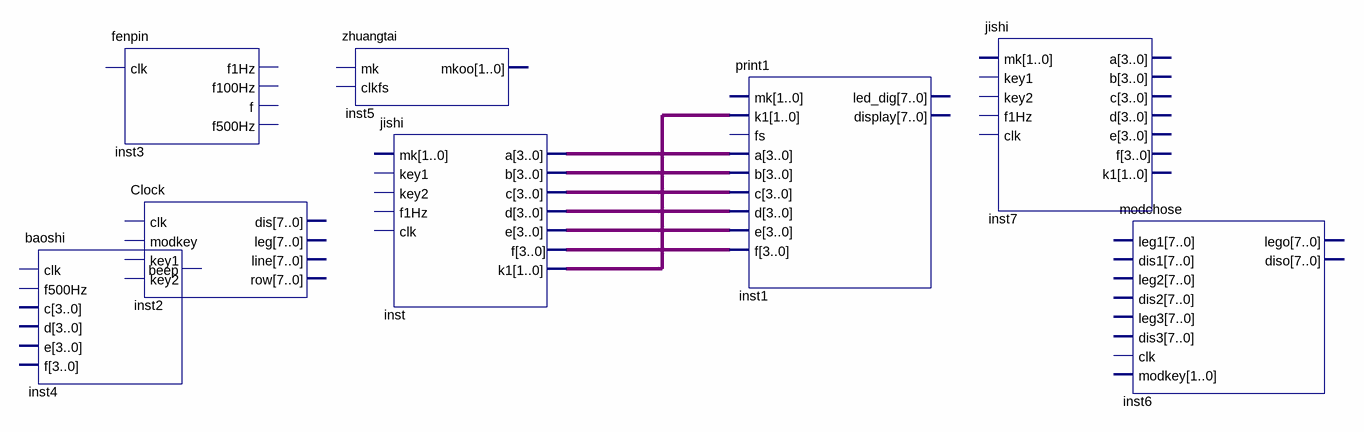
[diagram p0: schematic sheet]
// Quartus schematic Block1.bdf as structural Verilog: 8 symbols, 0 pins
module Block1 (
);

  wire [1:0] inst_k1;
  wire [3:0] inst_a, inst_b, inst_c, inst_d, inst_e, inst_f;

  baoshi inst4 ();  // open: clk, f500Hz, c, d, e, f, beep
  fenpin inst3 ();  // open: clk, f1Hz, f100Hz, f, f500Hz
  Clock inst2 ();  // open: clk, modkey, key1, key2, dis, leg, line, row
  zhuangtai inst5 ();  // open: mk, clkfs, mkoo
  jishi inst (
    .a(inst_a), .b(inst_b), .c(inst_c), .d(inst_d), .e(inst_e), .f(inst_f), .k1(inst_k1));  // open: mk, key1, key2, f1Hz, clk
  print1 inst1 (
    .k1(inst_k1), .a(inst_a), .b(inst_b), .c(inst_c), .d(inst_d), .e(inst_e), .f(inst_f));  // open: mk, fs, led_dig, display
  jishi inst7 ();  // open: mk, key1, key2, f1Hz, clk, a, b, c, d, e, f, k1
  modchose inst6 ();  // open: leg1, dis1, leg2, dis2, leg3, dis3, clk, modkey, lego, diso
endmodule
